# Altium project P211_Data_Logger.PrjPcb
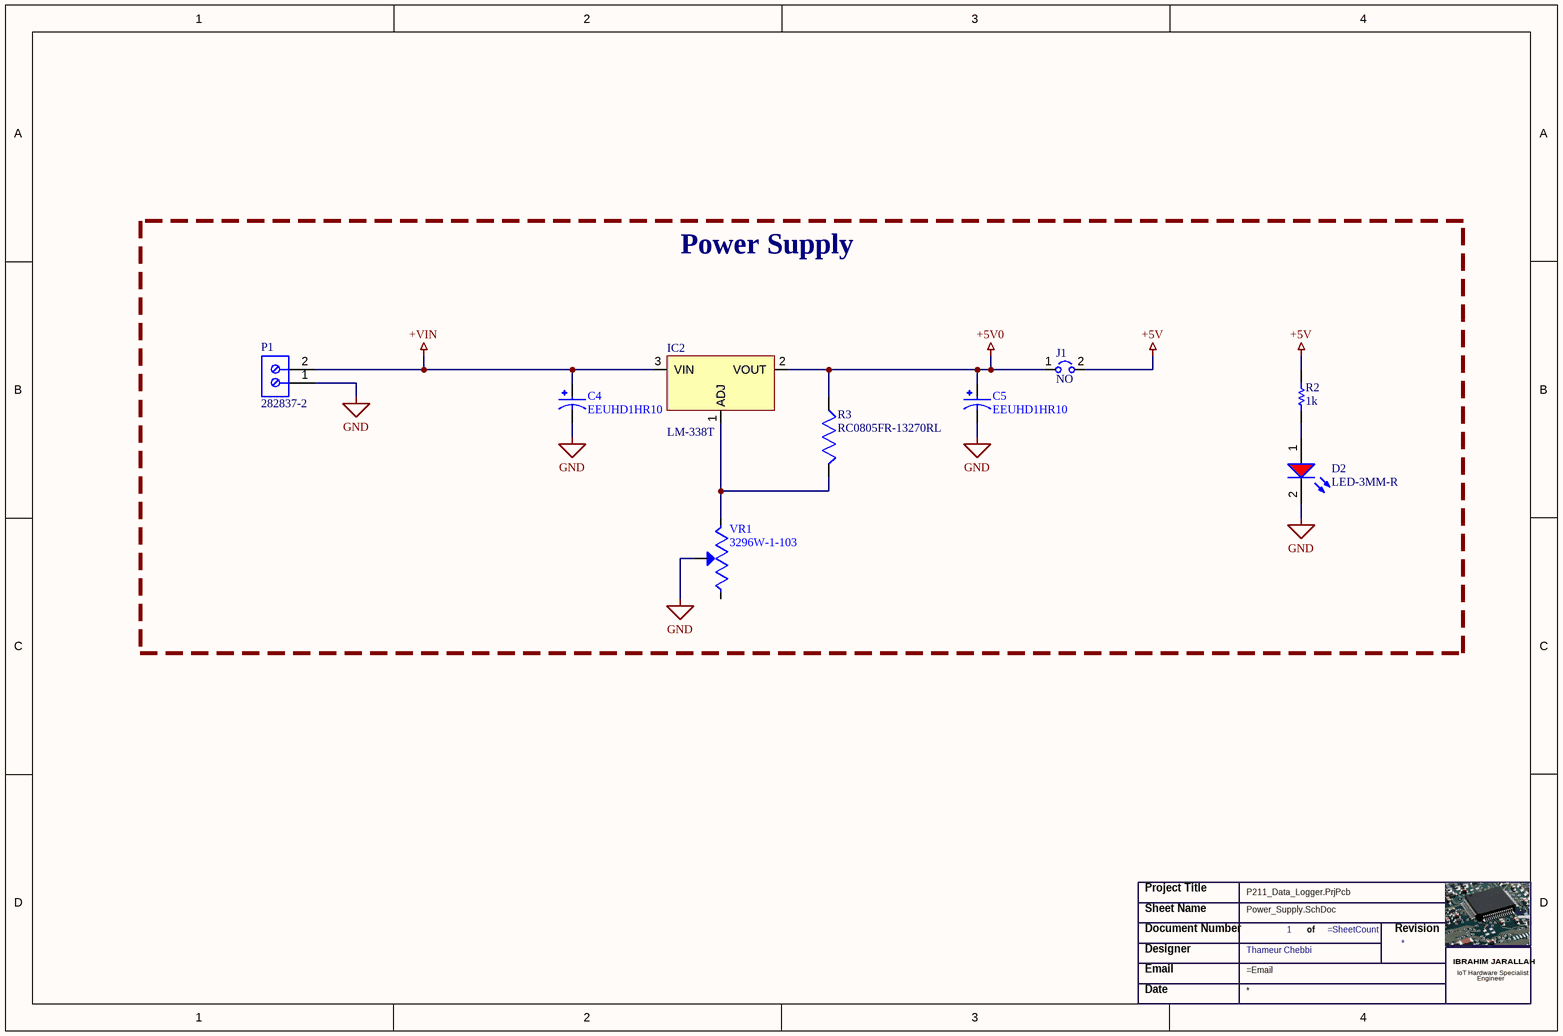
[diagram p0: Power_Supply.SchDoc]
Designer: Thameur Chebbi
3 sheets, 33 parts. Net scope: global (net labels, ports and power ports of the same name join across sheets).
Board file: P211_Data_Logger.PcbDoc
Sheets:
  Power_Supply.SchDoc
  MCU.SchDoc
  Interfaces.SchDoc

## Sheet Power_Supply.SchDoc
size A4; DocumentNumber: 1; SheetNumber: 1; SheetTotal: 3

### Parts
(Parts that share a designator on the sheet are numbered #1, #2 ... from top to bottom, then left to right.)
*#1  Title_block_Medium  (value not drawn)
C4  EEUHD1HR10  [CAP_ALUM_5x11_RM2.5]
C5  EEUHD1HR10  [CAP_ALUM_5x11_RM2.5]
D2  LED-3MM-R  [LED-2.54MM-R]
IC2  LM-338T  [TO-220-3]
J1  NO  [Jumper]
P1  282837-2  [TE_282837-2]
R2  1k  [RESC2013X50X30LL20T20]
R3  RC0805FR-13270RL  [RESC2012X60N]
VR1  3296W-1-103  [TRIM_3296W-1-103]

### Blocks framed on the sheet
Power Supply: C4 C5 D2 IC2 J1 P1 R2 R3 VR1

### Nets
+5V: J1.2 R2.1
+5V0: C5.1(P) IC2.2(VOUT) J1.1 R3.2
+VIN: C4.1(P) IC2.3(VIN) P1.2
GND: C4.2(N) C5.2(N) D2.2(K) P1.1 VR1.2(WIPER)
NetD2_1: D2.1(A) R2.2
NetIC2_1: IC2.1(ADJ) R3.1 VR1.3(CW)

Not connected (* = marked no-connect by the designer): VR1 1(CCW)

### Notes on the sheet
- Title:
- Formation Altium Designer Pro
- Sheet Name:
- Designer:
- Start Date:
- Page:
- Contact:
- of
- ct.formationelectronic@gmail.com
- Revision:
- End Date:
- Altium Designer Pro
- Formation
- (in symbol Title_block_Medium) Project Title; Sheet Name; Document Number; of; Revision; Designer; IBRAHIM JARALLAH; Email; IoT Hardware Specialist; Engineer; Date

### Library data of the parts
C4 C5 = EEUHD1HR10: MF: {'manufacturer': u'Panasonic'}; Package: None; Price: None; Value: *; MP: EEUHD1HR10; Availability: Unavailable
IC2 = IC_LM_338T
J1 = Jumper_NO
P1 = 282837-2: TERM BLOCK 5.08MM 2POS SIDE ENTY; MF: {'manufacturer': u'TE Connectivity'}; Package: None; Price: None; Value: *; MP: 282837-2; Availability: Unavailable
R2 = RES-0805-SMD: Value: 1k
R3 = RC0805FR-13270RL: MF: {'manufacturer': u'Yageo Corporation'}; Package: None; Price: None; Value: *; MP: RC0805FR-13270RL; Availability: Unavailable
VR1 = 3296W-1-103: MF: {'manufacturer': u'Bourns'}; Package: None; Price: None; Value: *; MP: 3296W-1-103; Availability: Unavailable

## Sheet MCU.SchDoc
size A4; DocumentNumber: 2; SheetNumber: 2; SheetTotal: 3
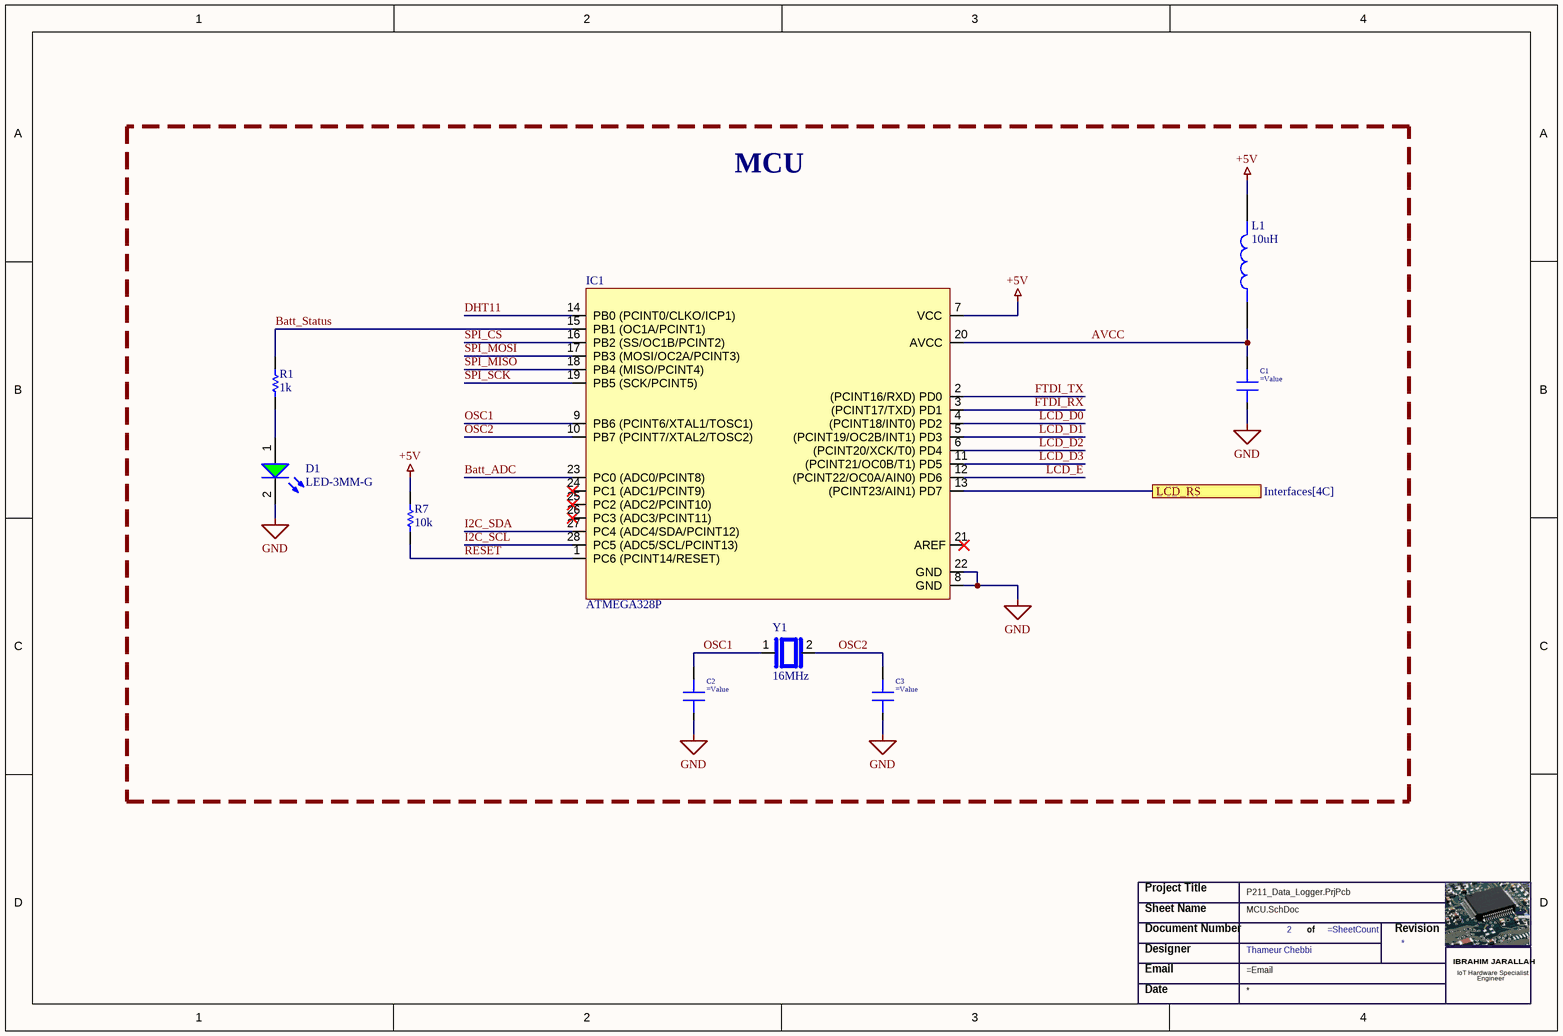
[diagram p1: MCU.SchDoc]

### Parts
(Parts that share a designator on the sheet are numbered #1, #2 ... from top to bottom, then left to right.)
*#2  Title_block_Medium  (value not drawn)
C1  (no value)  [C 0805(2012)x0.85]
C2  (no value)  [C 0805(2012)x0.85]
C3  (no value)  [C 0805(2012)x0.85]
D1  LED-3MM-G  [LED-2.54MM-G]
IC1  ATMEGA328P  [DIP28_P2.54mm_7.62mm]
L1  10uH  [IND_LQH31MN100J03L]
R1  1k  [RESC2013X50X30LL20T20]
R7  10k  [RESC2013X50X30LL20T20]
Y1  16MHz  [XTAL_HC49P488W43L1150T466H350]

### Blocks framed on the sheet
MCU: C1-C3 D1 IC1 L1 R1 R7 Y1

### Ports
LCD_RS (see Interfaces[4C])

### Nets
+5V: IC1.7(VCC) L1.2 R7.1
GND: C1.1 C2.1 C3.1 D1.2(K) IC1.8(GND) IC1.22(GND)
AVCC: C1.2 IC1.20(AVCC) L1.1
Batt_ADC: IC1.23(PC0_(ADC0/PCINT8))
Batt_Status: IC1.15(PB1_(OC1A/PCINT1)) R1.1
DHT11: IC1.14(PB0_(PCINT0/CLKO/ICP1))
FTDI_RX: IC1.3((PCINT17/TXD)_PD1)
FTDI_TX: IC1.2((PCINT16/RXD)_PD0)
I2C_SCL: IC1.28(PC5_(ADC5/SCL/PCINT13))
I2C_SDA: IC1.27(PC4_(ADC4/SDA/PCINT12))
LCD_D0: IC1.4((PCINT18/INT0)_PD2)
LCD_D1: IC1.5((PCINT19/OC2B/INT1)_PD3)
LCD_D2: IC1.6((PCINT20/XCK/T0)_PD4)
LCD_D3: IC1.11((PCINT21/OC0B/T1)_PD5)
LCD_E: IC1.12((PCINT22/OC0A/AIN0)_PD6)
LCD_RS: IC1.13((PCINT23/AIN1)_PD7) ; port LCD_RS
OSC1: C2.2 IC1.9(PB6_(PCINT6/XTAL1/TOSC1)) Y1.1
OSC2: C3.2 IC1.10(PB7_(PCINT7/XTAL2/TOSC2)) Y1.2
RESET: IC1.1(PC6_(PCINT14/RESET)) R7.2
SPI_CS: IC1.16(PB2_(SS/OC1B/PCINT2))
SPI_MISO: IC1.18(PB4_(MISO/PCINT4))
SPI_MOSI: IC1.17(PB3_(MOSI/OC2A/PCINT3))
SPI_SCK: IC1.19(PB5_(SCK/PCINT5))
NetD1_1: D1.1(A) R1.2

Not connected (* = marked no-connect by the designer): IC1 21(AREF)* 24(PC1_(ADC1/PCINT9))* 25(PC2_(ADC2/PCINT10))* 26(PC3_(ADC3/PCINT11))*

### Notes on the sheet
- Title:
- Formation Altium Designer Pro
- Sheet Name:
- Designer:
- Start Date:
- Page:
- Contact:
- of
- ct.formationelectronic@gmail.com
- Revision:
- End Date:
- Altium Designer Pro
- Formation
- (in symbol Title_block_Medium) Project Title; Sheet Name; Document Number; of; Revision; Designer; IBRAHIM JARALLAH; Email; IoT Hardware Specialist; Engineer; Date

### Library data of the parts
C1-C3 = C 0805    50V X7R - 0*: SMD 0805     50V X7R 10%; Manufacturer: Samsung; TYPE: Capacitors; Package-mm: 2012; Part Number: *; Mount Type: SMT; Publisher: Hefest; Manufacturer Alternate: *; Part Number Alternate: *; Published: 07.04.2019; Supplier 1: Comet; Supplier 2: *; Supplier 3: *; Supplier Part Number 1: *; Supplier Part Number 2: *; Supplier Part Number 3: *; RoHS: Y; Technology: Ceramic  MLCC; Value 1: *; Value 2: *; Package: 0805; VDC: 50V; TempCo: X7R; Tolerance %: ±10%; VAC: *; ESR Ohm: *; ComponentLink1Description: Datasheet link; ComponentLink1URL: https://store.comet.bg/download-file.php?id=11; Temperature Range: -55°C ~ +125°C; Price: *
IC1 = IC_ATMEGA328P_PDIP: Microcontroller, ATmega328P, 8-bit, PDIP-28 32kB Flash
L1 = LQH31MN100J03L: Wire Wound Ferrite Inductor for General Circuits; MF: {'manufacturer': u'Murata'}; Package: None; Price: None; Value: *; MP: LQH31MN100J03L; Availability: Unavailable
R1 = RES-0805-SMD: Value: 1k
R7 = RES-0805-SMD: Value: 1k
Y1 = HC-49/U-S16000000ABJB: HC49US Series 16 MHz Â±30 ppm 18 pF -20 to +70 Â°C Through Hole AT-CUT Crystal; MF: {'manufacturer': u'Citizen Finedevice'}; Package: None; Price: None; Value: *; MP: HC-49/U-S16000000ABJB; Availability: Unavailable

## Sheet Interfaces.SchDoc
size A4; DocumentNumber: 3; SheetNumber: 3; SheetTotal: 3
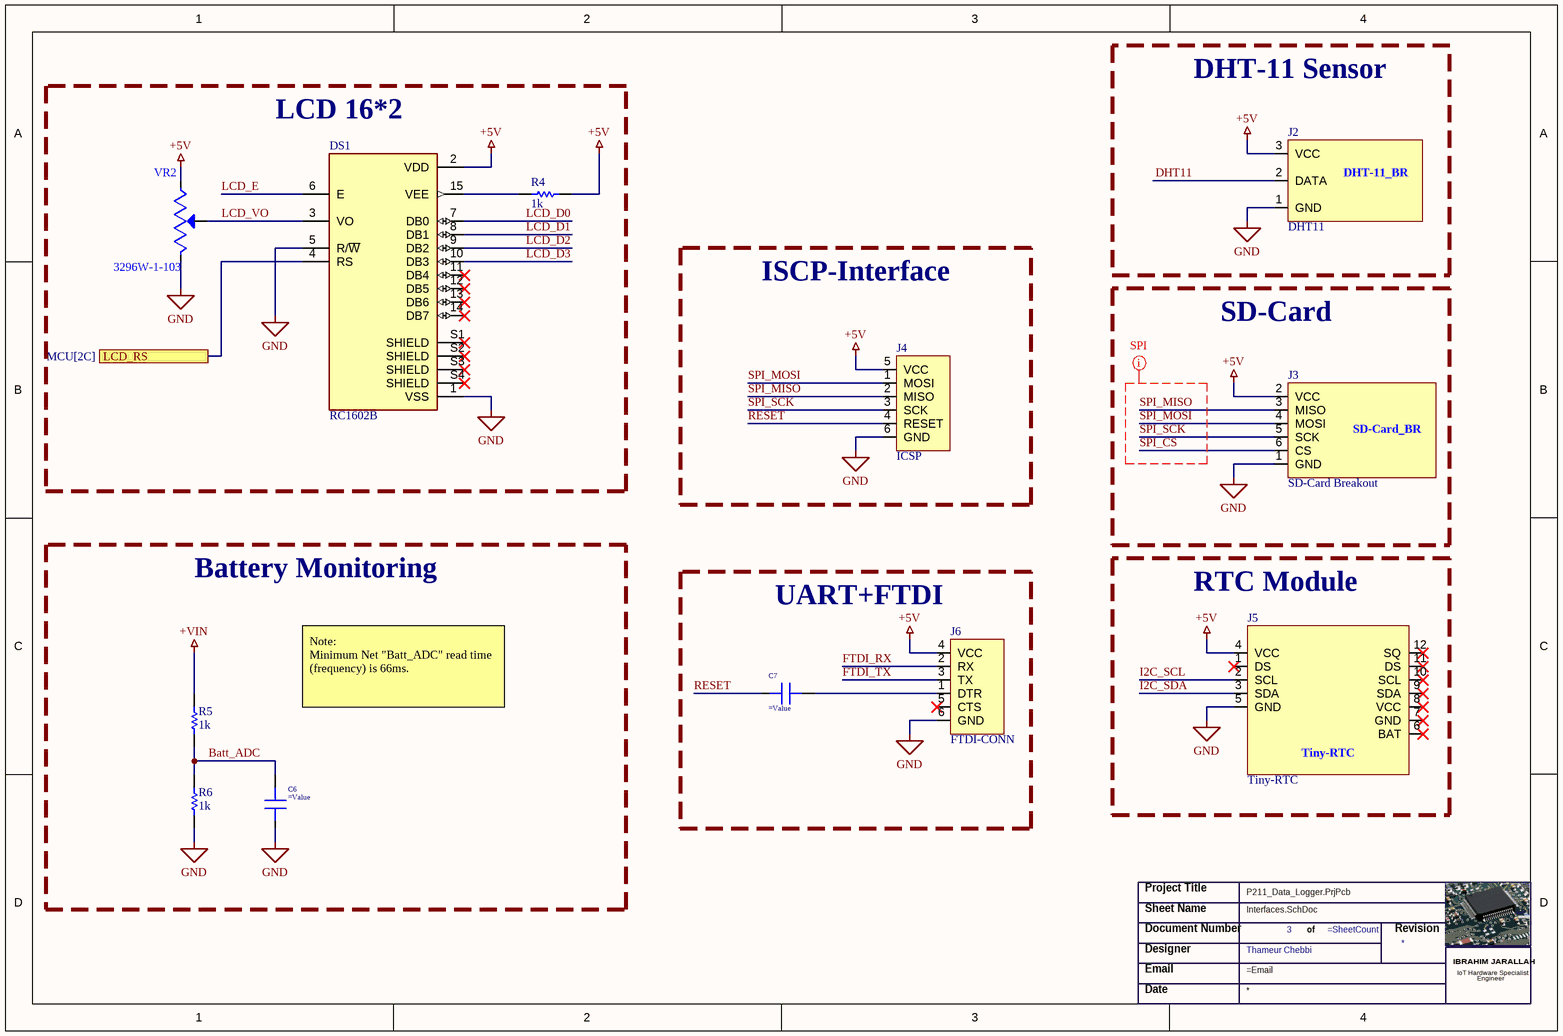
[diagram p2: Interfaces.SchDoc]

### Parts
(Parts that share a designator on the sheet are numbered #1, #2 ... from top to bottom, then left to right.)
*#3  Title_block_Medium  (value not drawn)
C6  (no value)  [C 0805(2012)x0.85]
C7  (no value)  [C 0805(2012)x0.85]
DS1  RC1602B  [LCD_RC1602B-BIW-CSV]
J2  DHT11  [DHT11-BREAKOUT]
J3  SD-Card Breakout  [SD-Card Breakout]
J4  ICSP  [FTDI]
J5  Tiny-RTC  [Tiny-RTC]
J6  FTDI-CONN  [FTDI]
R4  1k  [RESC2013X50X30LL20T20]
R5  1k  [FP-CRCW1206-e3-IPC_B]
R6  1k  [FP-CRCW1206-e3-IPC_B]
VR2  3296W-1-103  [TRIM_3296W-1-103]

### Blocks framed on the sheet
LCD 16*2: DS1 R4 VR2
DHT-11 Sensor: J2
ISCP-Interface: J4
SD-Card: J3
Battery Monitoring: C6 R5 R6
RTC Module: J5
UART+FTDI: C7 J6

### Ports
LCD_RS (see MCU[2C])

### Nets
+5V: DS1.2(VDD) J2.3(VCC) J3.2(VCC) J4.5(VCC) J5.4(VCC) J6.4(VCC) R4.1 VR2.3(CW)
+VIN: R5.2
GND: C6.1 DS1.1(VSS) DS1.5(R/~{W}) J2.1(GND) J3.1(GND) J4.6(GND) J5.5(GND) J6.6(GND) R6.1 VR2.1(CCW)
Batt_ADC: C6.2 R5.1 R6.2
DHT11: J2.2(DATA)
FTDI_RX: J6.2(RX)
FTDI_TX: J6.3(TX)
I2C_SCL: J5.2(SCL)
I2C_SDA: J5.3(SDA)
LCD_D0: DS1.7(DB0)
LCD_D1: DS1.8(DB1)
LCD_D2: DS1.9(DB2)
LCD_D3: DS1.10(DB3)
LCD_E: DS1.6(E)
LCD_RS: DS1.4(RS) ; port LCD_RS
LCD_VO: DS1.3(VO) VR2.2(WIPER)
RESET: C7.1 J4.4(RESET)
SPI_CS: J3.6(CS)
SPI_MISO: J3.3(MISO) J4.2(MISO)
SPI_MOSI: J3.4(MOSI) J4.1(MOSI)
SPI_SCK: J3.5(SCK) J4.3(SCK)
NetC7_2: C7.2 J6.1(DTR)
NetDS1_15: DS1.15(VEE) R4.2

Not connected (* = marked no-connect by the designer): DS1 11(DB4)* 12(DB5)* 13(DB6)* 14(DB7)* S1(SHIELD)* S2(SHIELD)* S3(SHIELD)* S4(SHIELD)*; J5 1(DS)* 6(BAT)* 7(GND)* 8(VCC)* 9(SDA)* 10(SCL)* 11(DS)* 12(SQ)*; J6 5(CTS)*

### Layout directives
net class SPI: SPI_CS, SPI_MISO, SPI_MOSI, SPI_SCK

### Notes on the sheet
- Note:
  Minimum Net "Batt_ADC" read time (frequency) is 66ms.
- Title:
- Formation Altium Designer Pro
- Sheet Name:
- Designer:
- Start Date:
- Page:
- Contact:
- of
- ct.formationelectronic@gmail.com
- Revision:
- End Date:
- Altium Designer Pro
- Formation
- (in symbol DHT11) DHT-11_BR
- (in symbol SD-Card Breakout) SD-Card_BR
- (in symbol Title_block_Medium) Project Title; Sheet Name; Document Number; of; Revision; Designer; IBRAHIM JARALLAH; Email; IoT Hardware Specialist; Engineer; Date

### Library data of the parts
C6 C7 = C 0805    50V X7R - 0*: as C1 on sheet MCU; Part Number: *; Mount Type: SMT; Publisher: Hefest; Manufacturer Alternate: *; Part Number Alternate: *; Published: 07.04.2019; Supplier 1: Comet; Supplier 2: *; Supplier 3: *; Supplier Part Number 1: *; Supplier Part Number 2: *; Supplier Part Number 3: *; RoHS: Y; Technology: Ceramic  MLCC; Value 1: *; Value 2: *; Package: 0805; VDC: 50V; TempCo: X7R; Tolerance %: ±10%; VAC: *; ESR Ohm: *; ComponentLink1Description: Datasheet link; ComponentLink1URL: https://store.comet.bg/download-file.php?id=11; Temperature Range: -55°C ~ +125°C; Price: *
DS1 = RC1602B-BIW-CSV: Display: LCD; alphanumeric; STN Negative; 16x2; blue; LED; PIN: 16; MF: {'manufacturer': u'Raystar'}; Package: None; Price: None; Value: *; MP: RC1602B-BIW-CSV; Availability: Unavailable
J4 = ICSP: ICSP-CONN
J5 = Tiny-RTC Breakout Board
J6 = FTDI
R4 = RES-0805-SMD: Value: 1k
R5 R6 = RES-1206-SMD: Value: 1k
VR2 = 3296W-1-103: MF: {'manufacturer': u'Bourns'}; Package: None; Price: None; Value: *; MP: 3296W-1-103; Availability: Unavailable

## Nets that join several sheets
+5V: Power_Supply (J1.2 R2.1), MCU (IC1.7 L1.2 R7.1), Interfaces (8 pins)
+VIN: Power_Supply (C4.1 IC2.3 P1.2), Interfaces (R5.2)
GND: Power_Supply (5 pins), MCU (6 pins), Interfaces (10 pins)
Batt_ADC: MCU (IC1.23), Interfaces (C6.2 R5.1 R6.2)
DHT11: MCU (IC1.14), Interfaces (J2.2)
FTDI_RX: MCU (IC1.3), Interfaces (J6.2)
FTDI_TX: MCU (IC1.2), Interfaces (J6.3)
I2C_SCL: MCU (IC1.28), Interfaces (J5.2)
I2C_SDA: MCU (IC1.27), Interfaces (J5.3)
LCD_D0: MCU (IC1.4), Interfaces (DS1.7)
LCD_D1: MCU (IC1.5), Interfaces (DS1.8)
LCD_D2: MCU (IC1.6), Interfaces (DS1.9)
LCD_D3: MCU (IC1.11), Interfaces (DS1.10)
LCD_E: MCU (IC1.12), Interfaces (DS1.6)
LCD_RS: MCU (IC1.13), Interfaces (DS1.4)
RESET: MCU (IC1.1 R7.2), Interfaces (C7.1 J4.4)
SPI_CS: MCU (IC1.16), Interfaces (J3.6)
SPI_MISO: MCU (IC1.18), Interfaces (J3.3 J4.2)
SPI_MOSI: MCU (IC1.17), Interfaces (J3.4 J4.1)
SPI_SCK: MCU (IC1.19), Interfaces (J3.5 J4.3)